# Altium schematic sheet 485.SchDoc
size A4; SheetNumber: 5; SheetTotal: 6
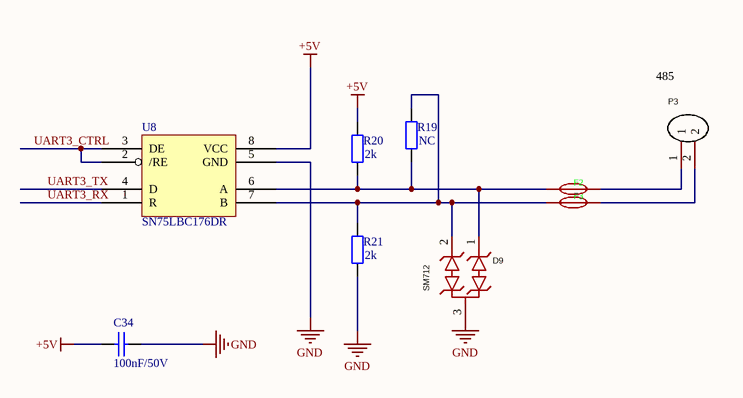
[diagram p0: 485.SchDoc]

## Parts
C34  100nF/50V  [C-0805]
D9  SM712  [SOT-23-3]
F2  SMD1206-020-48  [F1206]  (value not drawn)
F3  SMD1206-020-48  [F1206]  (value not drawn)
P3  WJ500V-5.08-2P  [KF128-2P DG128]  (value not drawn)
R19  NC  [R-0805]
R20  2k  [R-0805]
R21  2k  [R-0805]
U8  SN75LBC176DR  [SOP-8]

## Nets
+5V: C34.1 R20.2 U8.8(VCC)
GND: C34.2 D9.3 R21.1 U8.5(GND)
UART3_CTRL: U8.2(/RE) U8.3(DE)
UART3_RX: U8.1(R)
UART3_TX: U8.4(D)
NetD9_1: D9.1 F2.1 R19.1 R20.1 U8.6(A)
NetD9_2: D9.2 F3.1 R19.2 R21.2 U8.7(B)
NetF2_2: F2.2 P3.1
NetF3_2: F3.2 P3.2

## Notes on the sheet
- (near P3) 485

## Library data of the parts
C34 = C普通电容: 电容
D9 = SM712_C7420375: Manufacturer: 宏迦橙; Add into BOM: yes; polarity: 双向; Reverse Stand-Off Voltage (Vrwm): 12V；7V; Maximum Clamping Voltage: 15V; Peak Pulse Current (Ipp): 12A; Peak Pulse Power Dissipation (Ppp): 300W; Breakdown Voltage: 7.5V；13.5V; Reverse Leakage Current (Ir): 100nA; Number of Lines: 双路; Type: ESD; Symbol: SM712_C7420375; Device: SM712_C7420375; LCSC Part Name: 丝印:7AM; Supplier Part: C7420375; Manufacturer Part: SM712; Supplier Footprint: SOT-23; JLCPCB Part Class: Extended Part; Datasheet: https://atta.szlcsc.com/upload/public/pdf/source/20230828/0FC27A1088C52CC912446121FEA414EC.pdf; Supplier: LCSC; Convert to PCB: yes; Operating Temperature: -55℃~125℃
F2 F3 = SMD1206-020-48: Manufacturer: 宏嘉诚; Add into BOM: yes; Voltage - Max: 48V; Current - Max: 40A; Hold Current: 200mA; Trip Current: 460mA; Power Dissipation: 600mW; Resistance - Initial (Ri) (Min): 350mΩ; Resistance - Post Trip (R1) (Max): 2.7Ω; Time to Trip(Max): 100ms; Symbol: SMD1206-020-48; Device: SMD1206-020-48; LCSC Part Name: SMD1206-020-48; Supplier Part: C46641003; Manufacturer Part: SMD1206-020-48; Supplier Footprint: 1206; JLCPCB Part Class: Extended Part; Datasheet: https://atta.szlcsc.com/upload/public/pdf/source/20250414/5AC46D2F961B725C9DB708C91B04DBEC.pdf; Supplier: LCSC; Convert to PCB: yes
P3 = WJ500V-5.08-2P: Manufacturer: KANGNEX(康奈克斯电气); Symbol: WJ500V-5.08-2P-14-00A; Add into BOM: yes; Pitch: 5.08mm; Structure: 1x2P; Number of PINs Per Row: 2; Current Rating (Max): 18A; Voltage Rating (Max): 250V; Wire Gauge - AWG: 14~30; Wire Gauge - mm2: 2.5; Name: WJ500V-5.08-2P; Device: WJ500V-5.08-2P; LCSC Part Name: 5.08mm 1x2P 排数:1 每排P数:2 直针 可拼接; Supplier Part: C8465; Manufacturer Part: WJ500V-5.08-2P; Supplier Footprint: 插件,P=5.08mm; JLCPCB Part Class: Extended Part; Datasheet: https://atta.szlcsc.com/upload/public/pdf/source/20191225/C8465_02D34CE5B5B4A53DF5891601D97FA9F4.pdf; Supplier: LCSC; Convert to PCB: yes; Number of Rows: 1; Mounting Style: 直针; Operating Temperature Range: -40℃~+105℃; Color: 绿色
R19-R21 = RES: 电阻; Value: 5.1K; Published: 8-Jun-2000; LatestRevisionDate: 17-Jul-2002; LatestRevisionNote: Re-released for DXP Platform.; PackageReference: AXIAL-0.4; Publisher: Altium Limited
U8 = 75LBC176: 芯片